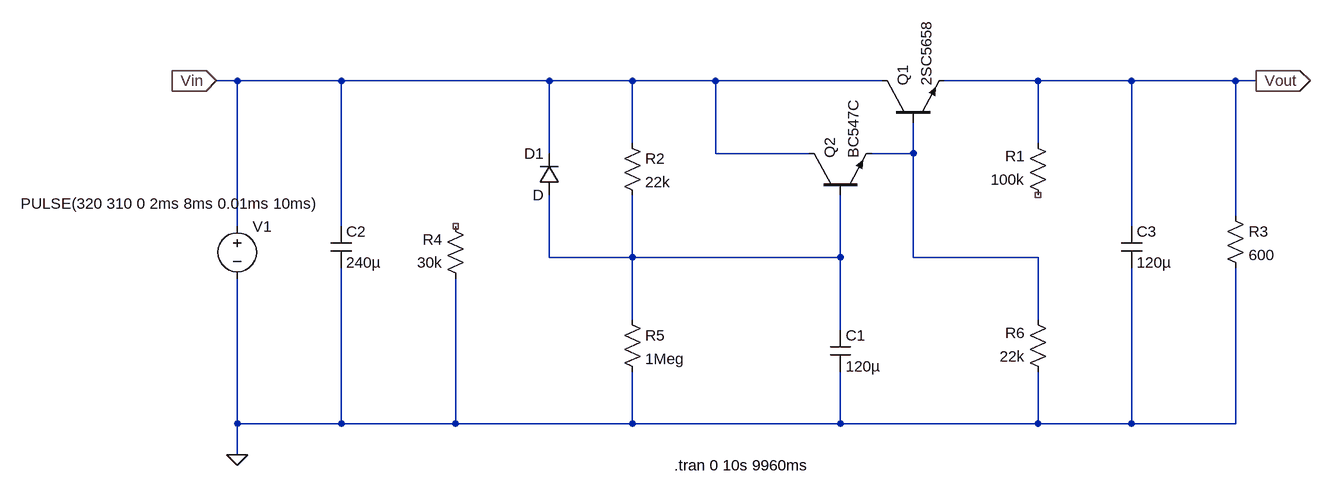
[diagram p0: schematic ripple_filter_pos_bipolar.asc]
ripple_filter_pos_bipolar.asc, the LTspice schematic file:
Version 4
SHEET 1 880 744
WIRE -816 96 -848 96
WIRE -656 96 -816 96
WIRE -336 96 -656 96
WIRE -208 96 -336 96
WIRE -80 96 -208 96
WIRE 176 96 -80 96
WIRE 416 96 272 96
WIRE 560 96 416 96
WIRE 720 96 560 96
WIRE 752 96 720 96
WIRE -208 192 -208 96
WIRE 416 192 416 96
WIRE -336 208 -336 96
WIRE -80 208 -80 96
WIRE 64 208 -80 208
WIRE 224 208 224 160
WIRE 224 208 160 208
WIRE 720 304 720 96
WIRE -816 320 -816 96
WIRE -656 320 -656 96
WIRE 560 320 560 96
WIRE -336 368 -336 272
WIRE -208 368 -208 272
WIRE -208 368 -336 368
WIRE 112 368 112 272
WIRE 112 368 -208 368
WIRE 224 368 224 208
WIRE 416 368 224 368
WIRE -208 464 -208 368
WIRE 416 464 416 368
WIRE 112 480 112 368
WIRE -816 624 -816 400
WIRE -656 624 -656 384
WIRE -656 624 -816 624
WIRE -480 624 -480 400
WIRE -480 624 -656 624
WIRE -208 624 -208 544
WIRE -208 624 -480 624
WIRE 112 624 112 544
WIRE 112 624 -208 624
WIRE 416 624 416 544
WIRE 416 624 112 624
WIRE 560 624 560 384
WIRE 560 624 416 624
WIRE 720 624 720 384
WIRE 720 624 560 624
WIRE -816 672 -816 624
FLAG -816 672 0
FLAG -848 96 Vin
IOPIN -848 96 In
FLAG 752 96 Vout
IOPIN 752 96 Out
SYMBOL npn 176 160 R270
SYMATTR InstName Q1
SYMATTR Value 2SC5658
SYMBOL npn 64 272 R270
SYMATTR InstName Q2
SYMATTR Value BC547C
SYMBOL res 432 288 R180
WINDOW 0 36 76 Left 2
WINDOW 3 36 40 Left 2
SYMATTR InstName R1
SYMATTR Value 100k
SYMBOL res -224 176 R0
SYMATTR InstName R2
SYMATTR Value 22k
SYMBOL diode -320 272 R180
WINDOW 0 24 64 Left 2
WINDOW 3 24 0 Left 2
SYMATTR InstName D1
SYMBOL cap 96 480 R0
SYMATTR InstName C1
SYMATTR Value 120µ
SYMBOL res 704 288 R0
SYMATTR InstName R3
SYMATTR Value 600
SYMBOL voltage -816 304 R0
WINDOW 123 0 0 Left 0
WINDOW 39 0 0 Left 0
WINDOW 3 -333 -19 Left 2
SYMATTR InstName V1
SYMATTR Value PULSE(320 310 0 2ms 8ms 0.01ms 10ms)
SYMBOL cap -672 320 R0
SYMATTR InstName C2
SYMATTR Value 240µ
SYMBOL res -464 416 R180
WINDOW 0 36 76 Left 2
WINDOW 3 36 40 Left 2
SYMATTR InstName R4
SYMATTR Value 30k
SYMBOL res -224 448 R0
SYMATTR InstName R5
SYMATTR Value 1Meg
SYMBOL res 432 560 R180
WINDOW 0 36 76 Left 2
WINDOW 3 36 40 Left 2
SYMATTR InstName R6
SYMATTR Value 22k
SYMBOL cap 544 320 R0
SYMATTR InstName C3
SYMATTR Value 120µ
TEXT -144 688 Left 2 !.tran 0 10s 9960ms

The netlist it stands for:
* ripple_filter_pos_bipolar.asc
Q1 Vin N001 Vout 0 2SC5658
Q2 Vin N002 N001 0 BC547C
R1 NC_01 Vout 100k
R2 Vin N002 22k
D1 N002 Vin D
C1 N002 0 120µ
R3 Vout 0 600
V1 Vin 0 PULSE(320 310 0 2ms 8ms 0.01ms 10ms)
C2 Vin 0 240µ
R4 0 NC_02 30k
R5 N002 0 1Meg
R6 0 N001 22k
C3 Vout 0 120µ
.model D D
.lib standard.dio
.model NPN NPN
.model PNP PNP
.lib standard.bjt
.tran 0 10s 9960ms
.backanno
.end